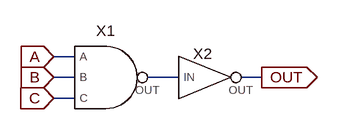
[diagram p0: schematic AND3.asc]
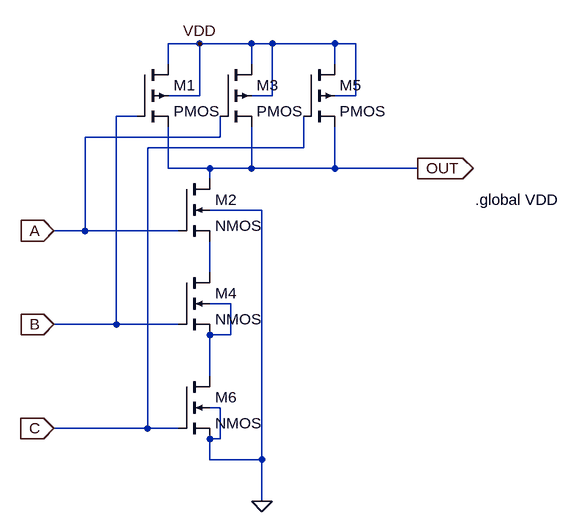
[diagram p1: sub-circuit nand3.asc]
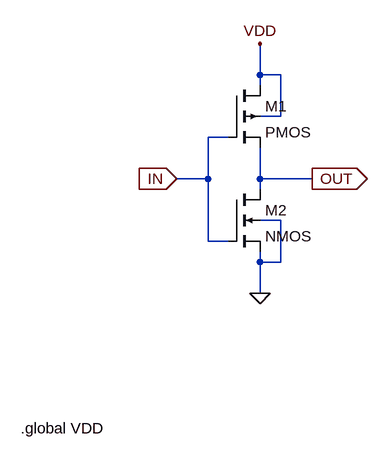
[diagram p2: sub-circuit inverter.asc]
AND3.asc, the LTspice schematic file:
Version 4
SHEET 1 880 680
WIRE 112 144 80 144
WIRE 112 176 80 176
WIRE 272 176 224 176
WIRE 400 176 368 176
WIRE 112 208 80 208
FLAG 80 144 A
IOPIN 80 144 In
FLAG 80 176 B
IOPIN 80 176 In
FLAG 80 208 C
IOPIN 80 208 In
FLAG 400 176 OUT
IOPIN 400 176 Out
SYMBOL NAND3 160 176 R0
SYMATTR InstName X1
SYMBOL inverter 304 176 R0
SYMATTR InstName X2

nand3.asc, the sub-circuit schematic file:
Version 4
SHEET 1 1380 1940
WIRE -64 -112 -112 -112
WIRE 16 -112 -64 -112
WIRE 48 -112 16 -112
WIRE 144 -112 48 -112
WIRE 176 -112 144 -112
WIRE -112 -80 -112 -112
WIRE 16 -80 16 -112
WIRE 144 -80 144 -112
WIRE -64 -32 -64 -112
WIRE -64 -32 -112 -32
WIRE 48 -32 48 -112
WIRE 48 -32 16 -32
WIRE 176 -32 176 -112
WIRE 176 -32 144 -32
WIRE -160 0 -192 0
WIRE -32 32 -32 0
WIRE -32 32 -240 32
WIRE 96 48 96 0
WIRE 96 48 -144 48
WIRE -112 80 -112 16
WIRE -48 80 -112 80
WIRE 16 80 16 16
WIRE 16 80 -48 80
WIRE 144 80 144 16
WIRE 144 80 16 80
WIRE 272 80 144 80
WIRE -48 96 -48 80
WIRE 32 144 -48 144
WIRE -240 176 -240 32
WIRE -240 176 -288 176
WIRE -96 176 -240 176
WIRE -48 240 -48 192
WIRE -16 288 -48 288
WIRE -192 320 -192 0
WIRE -192 320 -288 320
WIRE -96 320 -192 320
WIRE -16 336 -16 288
WIRE -16 336 -48 336
WIRE -48 400 -48 336
WIRE -32 448 -48 448
WIRE -144 480 -144 48
WIRE -144 480 -288 480
WIRE -96 480 -144 480
WIRE -32 496 -32 448
WIRE -32 496 -48 496
WIRE -48 528 -48 496
WIRE 32 528 32 144
WIRE 32 528 -48 528
WIRE 32 592 32 528
FLAG -288 320 B
IOPIN -288 320 In
FLAG -288 176 A
IOPIN -288 176 In
FLAG 32 592 0
FLAG -64 -112 VDD
FLAG 272 80 OUT
IOPIN 272 80 Out
FLAG -288 480 C
IOPIN -288 480 In
SYMBOL pmos4 -160 -80 R0
SYMATTR InstName M1
SYMATTR Value2 l=0.25u w=0.75u
SYMBOL nmos4 -96 96 R0
SYMATTR InstName M2
SYMATTR Value2 l=0.25u w=0.375u
SYMBOL pmos4 -32 -80 R0
SYMATTR InstName M3
SYMATTR Value2 l=0.25u w=0.75u
SYMBOL nmos4 -96 240 R0
SYMATTR InstName M4
SYMATTR Value2 l=0.25u w=0.375u
SYMBOL pmos4 96 -80 R0
SYMATTR InstName M5
SYMATTR Value2 l=0.25u w=0.75u
SYMBOL nmos4 -96 400 R0
SYMATTR InstName M6
SYMATTR Value2 l=0.25u w=0.375u
TEXT 360 128 Left 2 !.global VDD

inverter.asc, the sub-circuit schematic file:
Version 4
SHEET 1 1244 1940
WIRE -48 32 -48 -16
WIRE -16 32 -48 32
WIRE -48 48 -48 32
WIRE -16 96 -16 32
WIRE -16 96 -48 96
WIRE -96 128 -128 128
WIRE -128 192 -128 128
WIRE -128 192 -176 192
WIRE -48 192 -48 144
WIRE 32 192 -48 192
WIRE -48 208 -48 192
WIRE -16 256 -48 256
WIRE -128 288 -128 192
WIRE -96 288 -128 288
WIRE -48 320 -48 304
WIRE -16 320 -16 256
WIRE -16 320 -48 320
WIRE -48 368 -48 320
FLAG -48 368 0
FLAG -48 -16 VDD
FLAG -176 192 IN
IOPIN -176 192 In
FLAG 32 192 OUT
IOPIN 32 192 Out
SYMBOL pmos4 -96 48 R0
SYMATTR InstName M1
SYMATTR Value2 l=0.25u w=0.75u
SYMBOL nmos4 -96 208 R0
SYMATTR InstName M2
SYMATTR Value2 l=0.25u w=0.375u
TEXT -416 576 Left 2 !.global VDD

The netlist it stands for:
* AND3.asc
XX1 A B C N001 nand3
XX2 N001 OUT inverter

* block symbol definitions
.subckt nand3 A B C OUT
M1 VDD B OUT VDD PMOS l=0.25u w=0.75u
M2 OUT A N001 0 NMOS l=0.25u w=0.375u
M3 VDD A OUT VDD PMOS l=0.25u w=0.75u
M4 N001 B N002 N002 NMOS l=0.25u w=0.375u
M5 VDD C OUT VDD PMOS l=0.25u w=0.75u
M6 N002 C 0 0 NMOS l=0.25u w=0.375u
.global VDD
.ends nand3

.subckt inverter IN OUT
M1 VDD IN OUT VDD PMOS l=0.25u w=0.75u
M2 OUT IN 0 0 NMOS l=0.25u w=0.375u
.global VDD
.ends inverter

.model NMOS NMOS
.model PMOS PMOS
.lib standard.mos
.backanno
.end